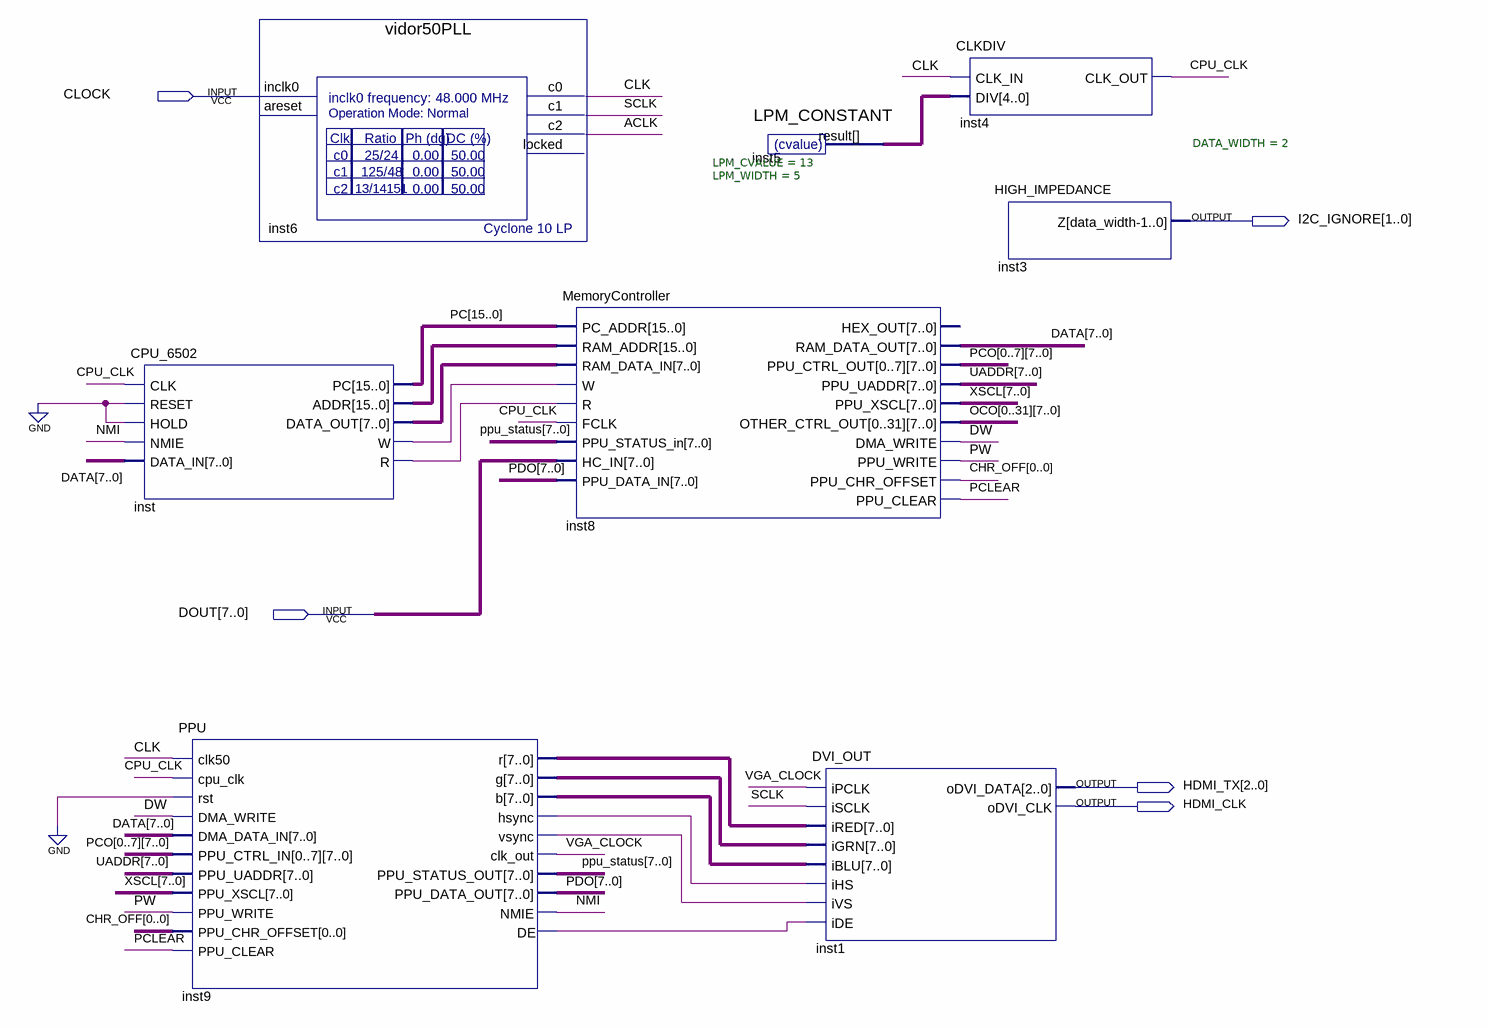
[diagram p0: schematic sheet]
// Quartus schematic NES.bdf as structural Verilog: 8 symbols, 5 pins
module NES (
  input  CLOCK,
  input  [7:0] DOUT,
  output [1:0] I2C_IGNORE,
  output [2:0] HDMI_TX,
  output HDMI_CLK
);

  wire ACLK, CLK, CPU_CLK, DW, inst9_de, inst9_hsync, inst9_vsync, inst_r, inst_w, NMI, PCLEAR, PW, SCLK,
       VGA_CLOCK;
  wire [0:0] CHR_OFF;
  wire [4:0] inst5_result;
  wire [7:0] DATA, inst9_b, inst9_g, inst9_r, inst_data_out, OCO_0, OCO_1, OCO_2, OCO_3, OCO_4, OCO_5, OCO_6,
       OCO_7, OCO_8, OCO_9, OCO_10, OCO_11, OCO_12, OCO_13, OCO_14, OCO_15, OCO_16, OCO_17, OCO_18, OCO_19,
       OCO_20, OCO_21, OCO_22, OCO_23, OCO_24, OCO_25, OCO_26, OCO_27, OCO_28, OCO_29, OCO_30, OCO_31, PCO_0,
       PCO_1, PCO_2, PCO_3, PCO_4, PCO_5, PCO_6, PCO_7, PDO, ppu_status, UADDR, XSCL;
  wire [15:0] inst_addr, PC;

  CPU_6502 inst (
    .CLK(CPU_CLK), .RESET(1'b0), .HOLD(1'b0), .NMIE(NMI), .DATA_IN(DATA), .DATA_OUT(inst_data_out),
    .W(inst_w), .R(inst_r), .PC(PC), .ADDR(inst_addr));
  PPU inst9 (
    .clk50(CLK), .cpu_clk(CPU_CLK), .rst(1'b0), .DMA_WRITE(DW), .DMA_DATA_IN(DATA),
    .PPU_CTRL_IN({PCO_0, PCO_1, PCO_2, PCO_3, PCO_4, PCO_5, PCO_6, PCO_7}), .PPU_UADDR(UADDR),
    .PPU_XSCL(XSCL), .PPU_WRITE(PW), .PPU_CHR_OFFSET(CHR_OFF[0]), .PPU_CLEAR(PCLEAR), .r(inst9_r),
    .g(inst9_g), .b(inst9_b), .hsync(inst9_hsync), .vsync(inst9_vsync), .clk_out(VGA_CLOCK),
    .PPU_STATUS_OUT(ppu_status), .PPU_DATA_OUT(PDO), .NMIE(NMI), .DE(inst9_de));
  vidor50PLL inst6 (.inclk0(CLOCK), .c0(CLK), .c1(SCLK), .c2(ACLK));  // open: areset, locked
  MemoryController inst8 (
    .PC_ADDR(PC), .RAM_ADDR(inst_addr), .RAM_DATA_IN(inst_data_out), .W(inst_w), .R(inst_r), .FCLK(CPU_CLK),
    .PPU_STATUS_in(ppu_status), .HC_IN(DOUT), .PPU_DATA_IN(PDO), .RAM_DATA_OUT(DATA),
    .PPU_CTRL_OUT({PCO_0, PCO_1, PCO_2, PCO_3, PCO_4, PCO_5, PCO_6, PCO_7}), .PPU_UADDR(UADDR),
    .PPU_XSCL(XSCL),
    .OTHER_CTRL_OUT({OCO_0, OCO_1, OCO_2, OCO_3, OCO_4, OCO_5, OCO_6, OCO_7, OCO_8, OCO_9, OCO_10, OCO_11, OCO_12, OCO_13, OCO_14, OCO_15, OCO_16, OCO_17, OCO_18, OCO_19, OCO_20, OCO_21, OCO_22, OCO_23, OCO_24, OCO_25, OCO_26, OCO_27, OCO_28, OCO_29, OCO_30, OCO_31}),
    .DMA_WRITE(DW), .PPU_WRITE(PW), .PPU_CHR_OFFSET(CHR_OFF[0]), .PPU_CLEAR(PCLEAR));  // open: HEX_OUT
  LPM_CONSTANT #(.LPM_CVALUE(13), .LPM_WIDTH(5)) inst5 (.result(inst5_result));
  DVI_OUT inst1 (
    .iPCLK(VGA_CLOCK), .iSCLK(SCLK), .iRED(inst9_r), .iGRN(inst9_g), .iBLU(inst9_b), .iHS(inst9_hsync),
    .iVS(inst9_vsync), .iDE(inst9_de), .oDVI_DATA(HDMI_TX), .oDVI_CLK(HDMI_CLK));
  CLKDIV inst4 (.CLK_IN(CLK), .DIV(inst5_result), .CLK_OUT(CPU_CLK));
  HIGH_IMPEDANCE #(.DATA_WIDTH(2)) inst3 (.Z(I2C_IGNORE));
endmodule
